# Altium schematic sheet DIOT_SMA_BASE.schdoc: DIOT_SMA16
size 594 x 420 mm; Author: A.B.; CompanyName: WUT; DrawnBy: A.B.; Organization: WUT ISE; Address1: Warsaw Univeristy of Technology; Address2: Nowowiejska 15/19; DocumentNumber: 1; SheetNumber: 1; SheetTotal: 2; EDA_Number: DIOT; Projet: KASLI 3U subsystem; ModifiedBy: -; CreateDate: XX/XX/XXXX; CheckedDate: -; DivGrp: ISE; Designer: A.B.; ModifiedDate: -; ProjectName: KASLI 3U subsystem
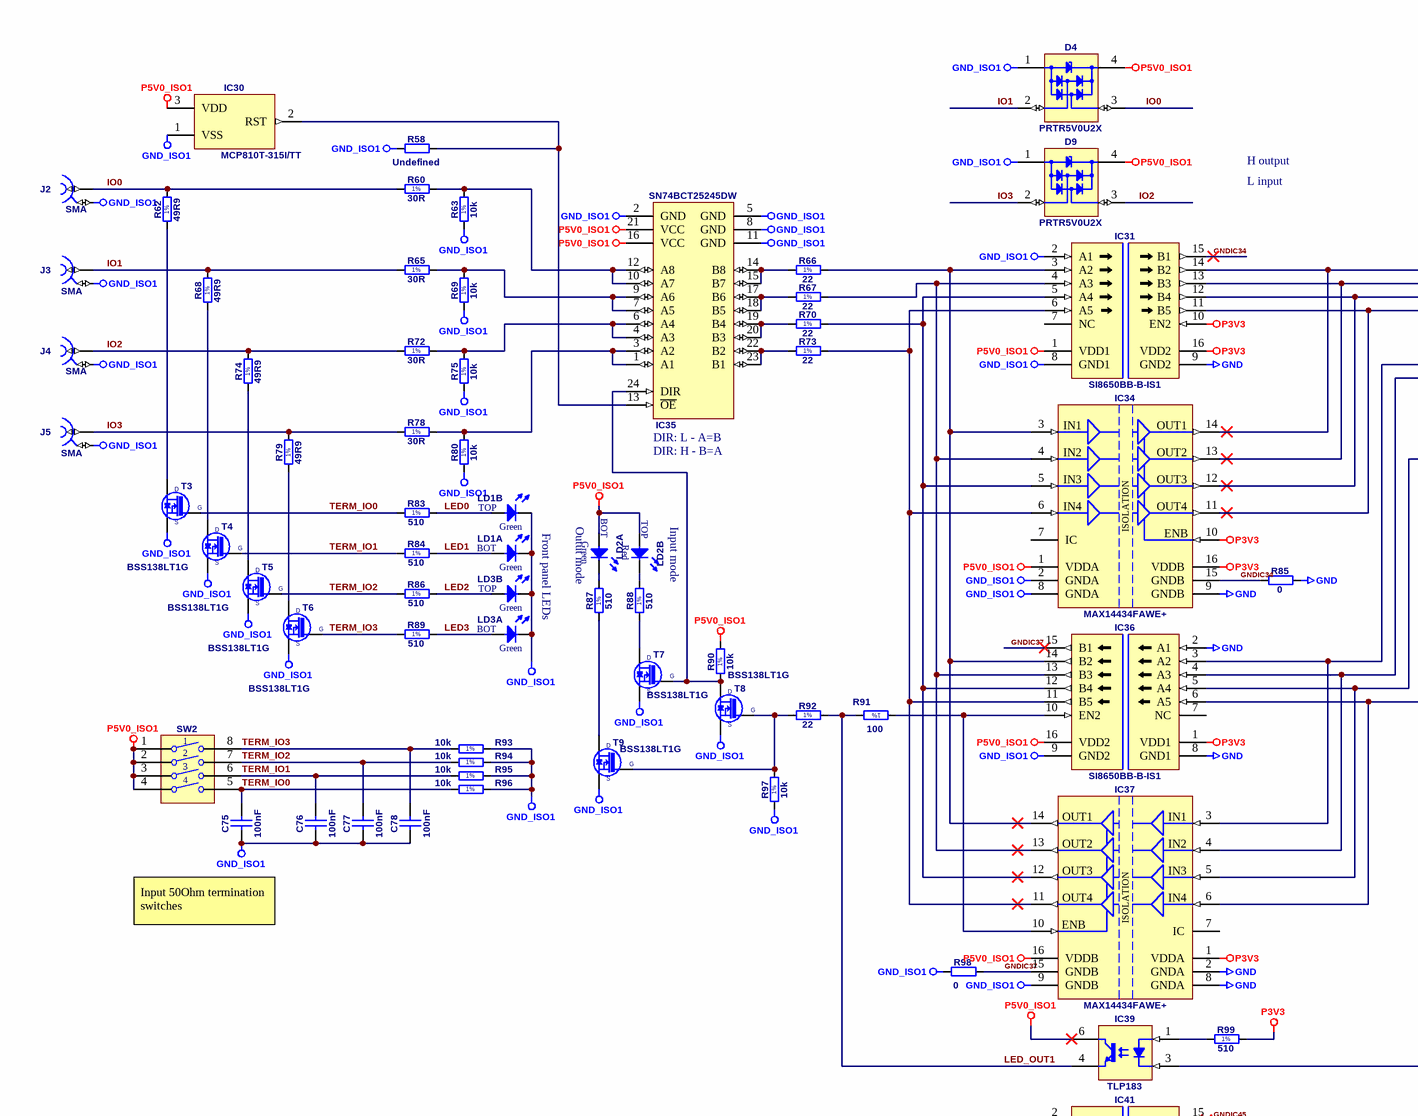
[diagram p0: DIOT_SMA_BASE.schdoc, top left]
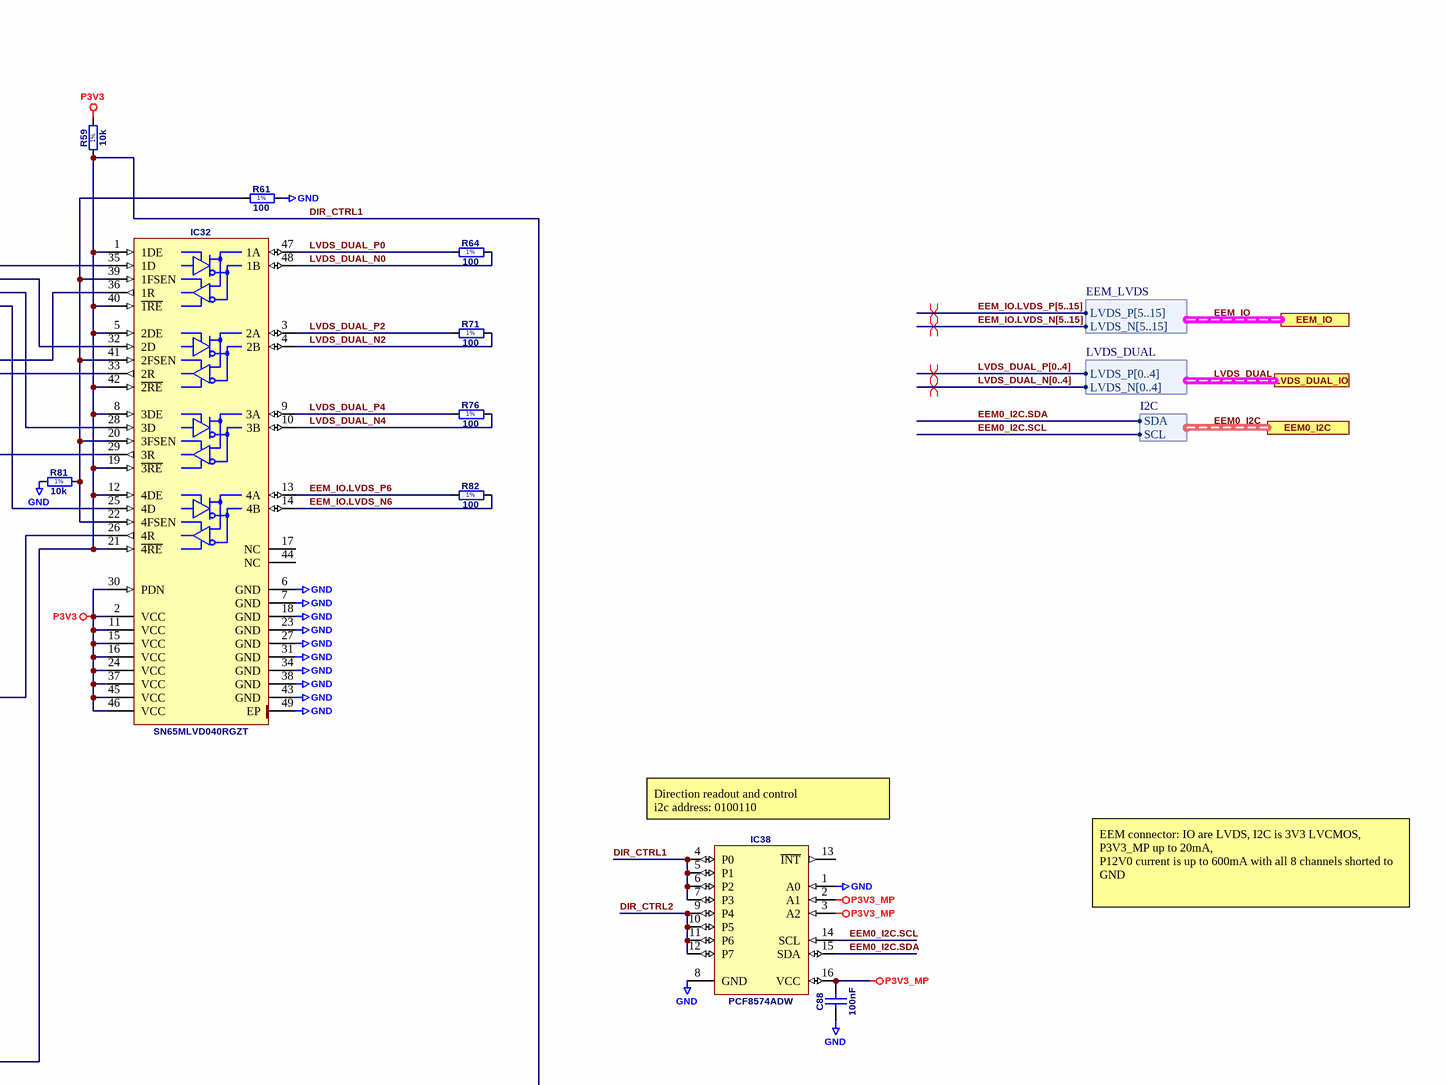
[diagram p1: DIOT_SMA_BASE.schdoc, top right]
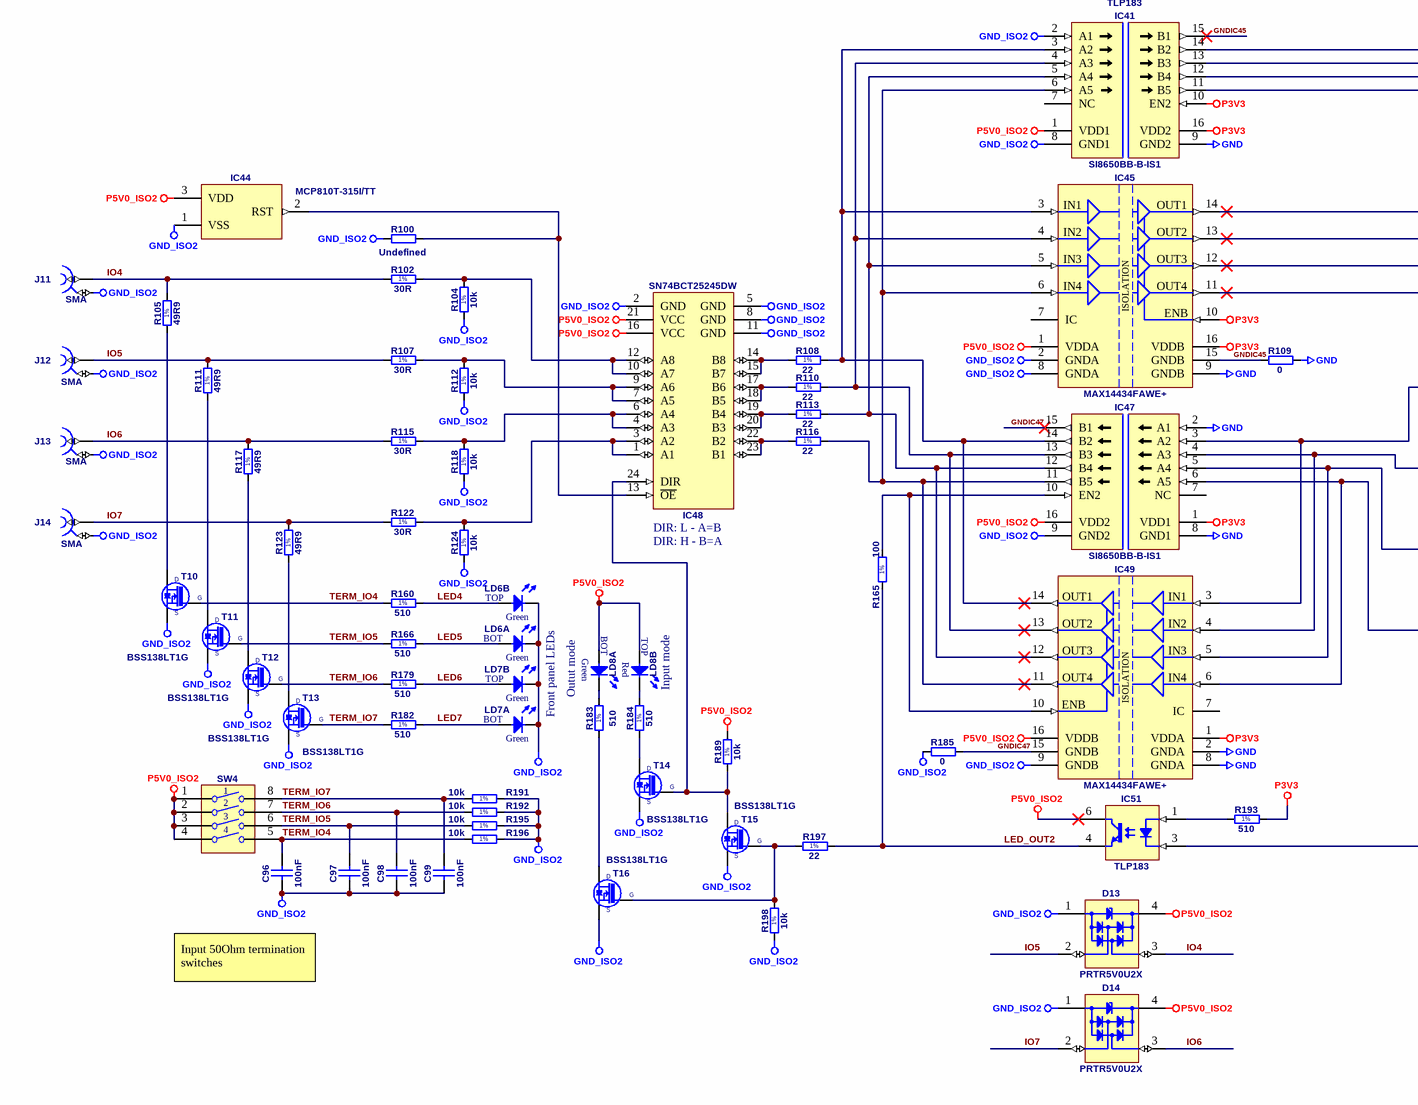
[diagram p2: DIOT_SMA_BASE.schdoc, bottom left]
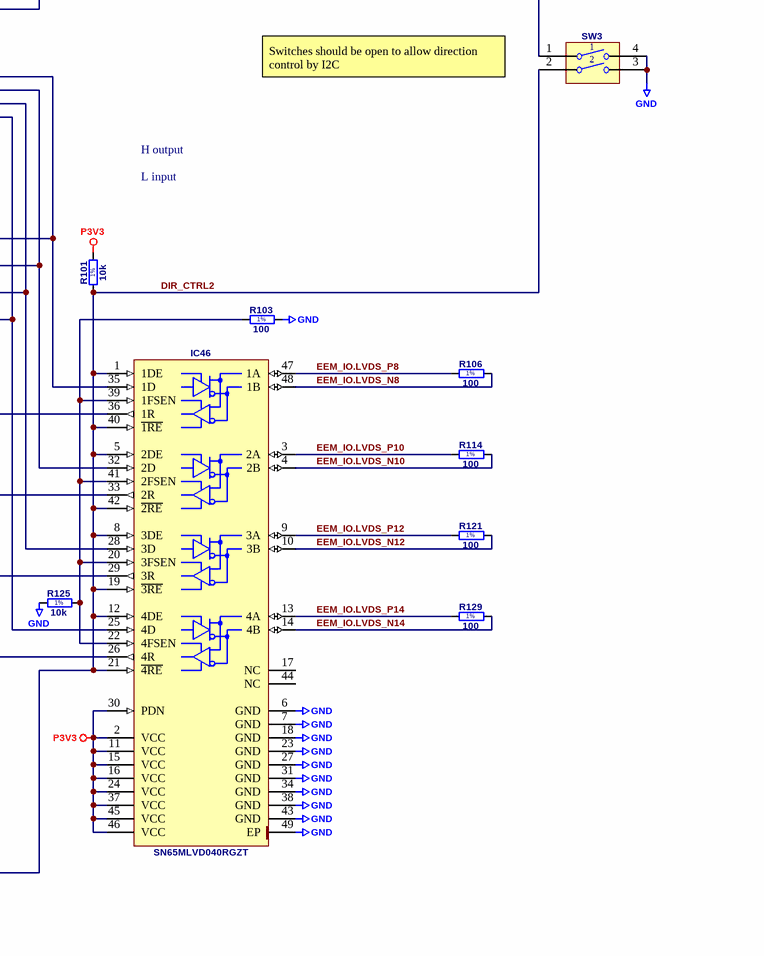
[diagram p3: DIOT_SMA_BASE.schdoc, bottom right]

## Parts
C75  100nF  [CAPC1005X55N]
C76  100nF  [CAPC1005X55N]
C77  100nF  [CAPC1005X55N]
C78  100nF  [CAPC1005X55N]
C88  100nF  [CAPC1005X55N]
C96  100nF  [CAPC1005X55N]
C97  100nF  [CAPC1005X55N]
C98  100nF  [CAPC1005X55N]
C99  100nF  [CAPC1005X55N]
D4  PRTR5V0U2X  [SOT190P230X110-4N]
D9  PRTR5V0U2X  [SOT190P230X110-4N]
D13  PRTR5V0U2X  [SOT190P230X110-4N]
D14  PRTR5V0U2X  [SOT190P230X110-4N]
IC30  MCP810T-315I/TT  [SOT95P237X112-3N]
IC31  SI8650BB-B-IS1  [SOIC127P600X175-16N]
IC32  SN65MLVD040RGZT  [QFN50P700X700X100-49N-S420]
IC34  MAX14434FAWE+  [SOIC127P1030X265-16N]
IC35  SN74BCT25245DW  [SOIC127P1030X265-24N]
IC36  SI8650BB-B-IS1  [SOIC127P600X175-16N]
IC37  MAX14434FAWE+  [SOIC127P1030X265-16N]
IC38  PCF8574ADW  [SOIC127P1030X265-16N]
IC39  TLP183  [TOSHIBA_11-4M1S]
IC41  SI8650BB-B-IS1  [SOIC127P600X175-16N]
IC44  MCP810T-315I/TT  [SOT95P237X112-3N]
IC45  MAX14434FAWE+  [SOIC127P1030X265-16N]
IC46  SN65MLVD040RGZT  [QFN50P700X700X100-49N-S420]
IC47  SI8650BB-B-IS1  [SOIC127P600X175-16N]
IC48  SN74BCT25245DW  [SOIC127P1030X265-24N]
IC49  MAX14434FAWE+  [SOIC127P1030X265-16N]
IC51  TLP183  [TOSHIBA_11-4M1S]
J2  SMA  [DELOCK_65848]
J3  SMA  [MOLEX_73251-2121]
J4  SMA  [DELOCK_65848]
J5  SMA  [MOLEX_73251-2121]
J11  SMA  [DELOCK_65848]
J12  SMA  [MOLEX_73251-2121]
J13  SMA  [DELOCK_65848]
J14  SMA  [MOLEX_73251-2121]
LD1  Green/Green  [LED_DIALIGHT_571-0122F]  (value not drawn)  (parts A,B of 2)
LD2  Red/Green  [LED_DIALIGHT_571-0112F]  (value not drawn)  (parts A,B of 2)
LD3  Green/Green  [LED_DIALIGHT_571-0122F]  (value not drawn)  (parts A,B of 2)
LD6  Green/Green  [LED_DIALIGHT_571-0122F]  (value not drawn)  (parts A,B of 2)
LD7  Green/Green  [LED_DIALIGHT_571-0122F]  (value not drawn)  (parts A,B of 2)
LD8  Red/Green  [LED_DIALIGHT_571-0112F]  (value not drawn)  (parts A,B of 2)
R58  Undefined  [RESC1005X40N]
R59  10k  [RESC1005X40N]
R60  30R  [RESC3225X70N]
R61  100  [RESC1005X40N]
R62  49R9  [RESC3225X70N]
R63  10k  [RESC1005X40N]
R64  100  [RESC1005X40N]
R65  30R  [RESC3225X70N]
R66  22  [RESC1005X40N]
R67  22  [RESC1005X40N]
R68  49R9  [RESC3225X70N]
R69  10k  [RESC1005X40N]
R70  22  [RESC1005X40N]
R71  100  [RESC1005X40N]
R72  30R  [RESC3225X70N]
R73  22  [RESC1005X40N]
R74  49R9  [RESC3225X70N]
R75  10k  [RESC1005X40N]
R76  100  [RESC1005X40N]
R78  30R  [RESC3225X70N]
R79  49R9  [RESC3225X70N]
R80  10k  [RESC1005X40N]
R81  10k  [RESC1005X40N]
R82  100  [RESC1005X40N]
R83  510  [RESC1005X40N]
R84  510  [RESC1005X40N]
R85  0  [RESC1005X40N]
R86  510  [RESC1005X40N]
R87  510  [RESC1005X40N]
R88  510  [RESC1005X40N]
R89  510  [RESC1005X40N]
R90  10k  [RESC1005X40N]
R91  100  [RESC1005X40N]
R92  22  [RESC1005X40N]
R93  10k  [RESC1005X40N]
R94  10k  [RESC1005X40N]
R95  10k  [RESC1005X40N]
R96  10k  [RESC1005X40N]
R97  10k  [RESC1005X40N]
R98  0  [RESC1005X40N]
R99  510  [RESC1005X40N]
R100  Undefined  [RESC1005X40N]
R101  10k  [RESC1005X40N]
R102  30R  [RESC3225X70N]
R103  100  [RESC1005X40N]
R104  10k  [RESC1005X40N]
R105  49R9  [RESC3225X70N]
R106  100  [RESC1005X40N]
R107  30R  [RESC3225X70N]
R108  22  [RESC1005X40N]
R109  0  [RESC1005X40N]
R110  22  [RESC1005X40N]
R111  49R9  [RESC3225X70N]
R112  10k  [RESC1005X40N]
R113  22  [RESC1005X40N]
R114  100  [RESC1005X40N]
R115  30R  [RESC3225X70N]
R116  22  [RESC1005X40N]
R117  49R9  [RESC3225X70N]
R118  10k  [RESC1005X40N]
R121  100  [RESC1005X40N]
R122  30R  [RESC3225X70N]
R123  49R9  [RESC3225X70N]
R124  10k  [RESC1005X40N]
R125  10k  [RESC1005X40N]
R129  100  [RESC1005X40N]
R160  510  [RESC1005X40N]
R165  100  [RESC1005X40N]
R166  510  [RESC1005X40N]
R179  510  [RESC1005X40N]
R182  510  [RESC1005X40N]
R183  510  [RESC1005X40N]
R184  510  [RESC1005X40N]
R185  0  [RESC1005X40N]
R189  10k  [RESC1005X40N]
R191  10k  [RESC1005X40N]
R192  10k  [RESC1005X40N]
R193  510  [RESC1005X40N]
R195  10k  [RESC1005X40N]
R196  10k  [RESC1005X40N]
R197  22  [RESC1005X40N]
R198  10k  [RESC1005X40N]
SW2  Switch  [SW_OMRON_A6S-4102-H]  (value not drawn)
SW3  Switch  [SW_OMRON_A6S-2102-H]  (value not drawn)
SW4  Switch  [SW_OMRON_A6S-4102-H]  (value not drawn)
T3  BSS138LT1G  [SOT95P240X110-3N]
T4  BSS138LT1G  [SOT95P240X110-3N]
T5  BSS138LT1G  [SOT95P240X110-3N]
T6  BSS138LT1G  [SOT95P240X110-3N]
T7  BSS138LT1G  [SOT95P240X110-3N]
T8  BSS138LT1G  [SOT95P240X110-3N]
T9  BSS138LT1G  [SOT95P240X110-3N]
T10  BSS138LT1G  [SOT95P240X110-3N]
T11  BSS138LT1G  [SOT95P240X110-3N]
T12  BSS138LT1G  [SOT95P240X110-3N]
T13  BSS138LT1G  [SOT95P240X110-3N]
T14  BSS138LT1G  [SOT95P240X110-3N]
T15  BSS138LT1G  [SOT95P240X110-3N]
T16  BSS138LT1G  [SOT95P240X110-3N]

## Ports
EEM0_I2C (harness I2C), EEM_IO (harness EEM_LVDS), LVDS_DUAL_IO (harness LVDS_DUAL)

## Harnesses
EEM_LVDS: LVDS_P[5..15], LVDS_N[5..15]
LVDS_DUAL: LVDS_P[0..4], LVDS_N[0..4]
I2C: SDA, SCL

## Nets
GND: C88.1 IC31.9(GND2) IC32.6(GND) IC32.7(GND) IC32.18(GND) IC32.23(GND) IC32.27(GND) IC32.31(GND) IC32.34(GND) IC32.38(GND) IC32.43(GND) IC32.49(EP) IC34.9(GNDB) IC36.2(A1) IC36.8(GND1) IC37.2(GNDA) IC37.8(GNDA) IC38.1(A0) IC38.8(GND) IC41.9(GND2) IC45.9(GNDB) IC46.6(GND) IC46.7(GND) IC46.18(GND) IC46.23(GND) IC46.27(GND) IC46.31(GND) IC46.34(GND) IC46.38(GND) IC46.43(GND) IC46.49(EP) IC47.2(A1) IC47.8(GND1) IC49.2(GNDA) IC49.8(GNDA) R61.2 R81.2 R85.2 R103.2 R109.2 R125.2 SW3.3 SW3.4
GND_ISO1: C75.1 C76.1 C77.1 C78.1 D4.1(GND) D9.1(GND) IC30.1(VSS) IC31.2(A1) IC31.8(GND1) IC34.2(GNDA) IC34.8(GNDA) IC35.2(GND) IC35.5(GND) IC35.8(GND) IC35.11(GND) IC36.9(GND2) IC37.9(GNDB) J2.2 J3.2 J4.2 J5.2 LD1.1(C) LD1.3(C) LD3.1(C) LD3.3(C) R58.1 R63.1 R69.1 R75.1 R80.1 R93.2 R94.2 R95.2 R96.2 R97.1 R98.1 T3.2(S) T4.2(S) T5.2(S) T6.2(S) T7.2(S) T8.2(S) T9.2(S)
GND_ISO2: C96.1 C97.1 C98.1 C99.1 D13.1(GND) D14.1(GND) IC41.2(A1) IC41.8(GND1) IC44.1(VSS) IC45.2(GNDA) IC45.8(GNDA) IC47.9(GND2) IC48.2(GND) IC48.5(GND) IC48.8(GND) IC48.11(GND) IC49.9(GNDB) J11.2 J12.2 J13.2 J14.2 LD6.1(C) LD6.3(C) LD7.1(C) LD7.3(C) R100.1 R104.1 R112.1 R118.1 R124.1 R185.1 R191.2 R192.2 R195.2 R196.2 R198.1 T10.2(S) T11.2(S) T12.2(S) T13.2(S) T14.2(S) T15.2(S) T16.2(S)
P3V3: IC31.10(EN2) IC31.16(VDD2) IC32.2(VCC) IC32.11(VCC) IC32.15(VCC) IC32.16(VCC) IC32.24(VCC) IC32.30(PDN) IC32.37(VCC) IC32.45(VCC) IC32.46(VCC) IC34.10(ENB) IC34.16(VDDB) IC36.1(VDD1) IC37.1(VDDA) IC41.10(EN2) IC41.16(VDD2) IC45.10(ENB) IC45.16(VDDB) IC46.2(VCC) IC46.11(VCC) IC46.15(VCC) IC46.16(VCC) IC46.24(VCC) IC46.30(PDN) IC46.37(VCC) IC46.45(VCC) IC46.46(VCC) IC47.1(VDD1) IC49.1(VDDA) R59.2 R99.2 R101.2 R193.2
P3V3_MP: C88.2 IC38.2(A1) IC38.3(A2) IC38.16(VCC)
P5V0_ISO1: D4.4(VCC) D9.4(VCC) IC30.3(VDD) IC31.1(VDD1) IC34.1(VDDA) IC35.16(VCC) IC35.21(VCC) IC36.16(VDD2) IC37.16(VDDB) IC39.6(C) LD2.2(A) LD2.4(A) R90.2 SW2.1 SW2.2 SW2.3 SW2.4
P5V0_ISO2: D13.4(VCC) D14.4(VCC) IC41.1(VDD1) IC44.3(VDD) IC45.1(VDDA) IC47.16(VDD2) IC48.16(VCC) IC48.21(VCC) IC49.16(VDDB) IC51.6(C) LD8.2(A) LD8.4(A) R189.2 SW4.1 SW4.2 SW4.3 SW4.4
DIR_CTRL1: IC32.1(1DE) IC32.5(2DE) IC32.8(3DE) IC32.12(4DE) IC32.19(~{3RE}) IC32.21(~{4RE}) IC32.40(~{1RE}) IC32.42(~{2RE}) IC38.4(P0) IC38.5(P1) IC38.6(P2) IC38.7(P3) IC39.3(C) R59.1 SW3.1
DIR_CTRL2: IC38.9(P4) IC38.10(P5) IC38.11(P6) IC38.12(P7) IC46.1(1DE) IC46.5(2DE) IC46.8(3DE) IC46.12(4DE) IC46.19(~{3RE}) IC46.21(~{4RE}) IC46.40(~{1RE}) IC46.42(~{2RE}) IC51.3(C) R101.1 SW3.2
EEM0_I2C.SCL: IC38.14(SCL) ; port EEM0_I2C.SCL
EEM0_I2C.SDA: IC38.15(SDA) ; port EEM0_I2C.SDA
EEM_IO.LVDS_N6: IC32.14(4B) R82.2
EEM_IO.LVDS_N8: IC46.48(1B) R106.2
EEM_IO.LVDS_N10: IC46.4(2B) R114.2
EEM_IO.LVDS_N12: IC46.10(3B) R121.2
EEM_IO.LVDS_N14: IC46.14(4B) R129.2
EEM_IO.LVDS_P6: IC32.13(4A) R82.1
EEM_IO.LVDS_P8: IC46.47(1A) R106.1
EEM_IO.LVDS_P10: IC46.3(2A) R114.1
EEM_IO.LVDS_P12: IC46.9(3A) R121.1
EEM_IO.LVDS_P14: IC46.13(4A) R129.1
GNDIC34: IC31.15(B1) IC34.15(GNDB) R85.1
GNDIC37: IC36.15(B1) IC37.15(GNDB) R98.2
GNDIC45: IC41.15(B1) IC45.15(GNDB) R109.1
GNDIC47: IC47.15(B1) IC49.15(GNDB) R185.2
IO0: D4.3(I/O2) J2.1 R60.1 R62.2
IO1: D4.2(I/O1) J3.1 R65.1 R68.2
IO2: D9.3(I/O2) J4.1 R72.1 R74.2
IO3: D9.2(I/O1) J5.1 R78.1 R79.2
IO4: D13.3(I/O2) J11.1 R102.1 R105.2
IO5: D13.2(I/O1) J12.1 R107.1 R111.2
IO6: D14.3(I/O2) J13.1 R115.1 R117.2
IO7: D14.2(I/O1) J14.1 R122.1 R123.2
LED0: LD1.4(A) R83.2
LED1: LD1.2(A) R84.2
LED2: LD3.4(A) R86.2
LED3: LD3.2(A) R89.2
LED4: LD6.4(A) R160.2
LED5: LD6.2(A) R166.2
LED6: LD7.4(A) R179.2
LED7: LD7.2(A) R182.2
LED_OUT1: IC39.4(E) R91.2 R92.2
LED_OUT2: IC51.4(E) R165.1 R197.2
LVDS_DUAL_N0: IC32.48(1B) R64.2
LVDS_DUAL_N2: IC32.4(2B) R71.2
LVDS_DUAL_N4: IC32.10(3B) R76.2
LVDS_DUAL_P0: IC32.47(1A) R64.1
LVDS_DUAL_P2: IC32.3(2A) R71.1
LVDS_DUAL_P4: IC32.9(3A) R76.1
TERM_IO0: C75.2 R83.1 R96.1 SW2.5 T3.1(G)
TERM_IO1: C76.2 R84.1 R95.1 SW2.6 T4.1(G)
TERM_IO2: C77.2 R86.1 R94.1 SW2.7 T5.1(G)
TERM_IO3: C78.2 R89.1 R93.1 SW2.8 T6.1(G)
TERM_IO4: C96.2 R160.1 R196.1 SW4.5 T10.1(G)
TERM_IO5: C97.2 R166.1 R195.1 SW4.6 T11.1(G)
TERM_IO6: C98.2 R179.1 R192.1 SW4.7 T12.1(G)
TERM_IO7: C99.2 R182.1 R191.1 SW4.8 T13.1(G)
NetIC30_2: IC30.2(RST) IC35.13(~{OE}) R58.2
NetIC31_3: IC31.3(A2) IC34.3(IN1) IC36.14(B2) IC37.14(OUT1) R66.2
NetIC31_4: IC31.4(A3) IC34.4(IN2) IC36.13(B3) IC37.13(OUT2) R67.2
NetIC31_5: IC31.5(A4) IC34.5(IN3) IC36.12(B4) IC37.12(OUT3) R70.2
NetIC31_6: IC31.6(A5) IC34.6(IN4) IC36.11(B5) IC37.11(OUT4) R73.2
NetIC31_11: IC31.11(B5) IC32.25(4D) IC34.11(OUT4)
NetIC31_12: IC31.12(B4) IC32.28(3D) IC34.12(OUT3)
NetIC31_13: IC31.13(B3) IC32.32(2D) IC34.13(OUT2)
NetIC31_14: IC31.14(B2) IC32.35(1D) IC34.14(OUT1)
NetIC32_20: IC32.20(3FSEN) IC32.22(4FSEN) IC32.39(1FSEN) IC32.41(2FSEN) R61.1 R81.1
NetIC32_26: IC32.26(4R) IC36.6(A5) IC37.6(IN4)
NetIC32_29: IC32.29(3R) IC36.5(A4) IC37.5(IN3)
NetIC32_33: IC32.33(2R) IC36.4(A3) IC37.4(IN2)
NetIC32_36: IC32.36(1R) IC36.3(A2) IC37.3(IN1)
NetIC35_1: IC35.1(A1) IC35.3(A2) R78.2 R80.2
NetIC35_4: IC35.4(A3) IC35.6(A4) R72.2 R75.2
NetIC35_7: IC35.7(A5) IC35.9(A6) R65.2 R69.2
NetIC35_10: IC35.10(A7) IC35.12(A8) R60.2 R63.2
NetIC35_14: IC35.14(B8) IC35.15(B7) R66.1
NetIC35_17: IC35.17(B6) IC35.18(B5) R67.1
NetIC35_19: IC35.19(B4) IC35.20(B3) R70.1
NetIC35_22: IC35.22(B2) IC35.23(B1) R73.1
NetIC35_24: IC35.24(DIR) R90.1 T7.1(G) T8.3(D)
NetIC36_10: IC36.10(EN2) IC37.10(ENB) R91.1
NetIC39_1: IC39.1(A) R99.1
NetIC41_3: IC41.3(A2) IC45.3(IN1) IC47.14(B2) IC49.14(OUT1) R108.2
NetIC41_4: IC41.4(A3) IC45.4(IN2) IC47.13(B3) IC49.13(OUT2) R110.2
NetIC41_5: IC41.5(A4) IC45.5(IN3) IC47.12(B4) IC49.12(OUT3) R113.2
NetIC41_6: IC41.6(A5) IC45.6(IN4) IC47.11(B5) IC49.11(OUT4) R116.2
NetIC41_11: IC41.11(B5) IC45.11(OUT4) IC46.25(4D)
NetIC41_12: IC41.12(B4) IC45.12(OUT3) IC46.28(3D)
NetIC41_13: IC41.13(B3) IC45.13(OUT2) IC46.32(2D)
NetIC41_14: IC41.14(B2) IC45.14(OUT1) IC46.35(1D)
NetIC44_2: IC44.2(RST) IC48.13(~{OE}) R100.2
NetIC46_20: IC46.20(3FSEN) IC46.22(4FSEN) IC46.39(1FSEN) IC46.41(2FSEN) R103.1 R125.1
NetIC46_26: IC46.26(4R) IC47.6(A5) IC49.6(IN4)
NetIC46_29: IC46.29(3R) IC47.5(A4) IC49.5(IN3)
NetIC46_33: IC46.33(2R) IC47.4(A3) IC49.4(IN2)
NetIC46_36: IC46.36(1R) IC47.3(A2) IC49.3(IN1)
NetIC47_10: IC47.10(EN2) IC49.10(ENB) R165.2
NetIC48_1: IC48.1(A1) IC48.3(A2) R122.2 R124.2
NetIC48_4: IC48.4(A3) IC48.6(A4) R115.2 R118.2
NetIC48_7: IC48.7(A5) IC48.9(A6) R107.2 R112.2
NetIC48_10: IC48.10(A7) IC48.12(A8) R102.2 R104.2
NetIC48_14: IC48.14(B8) IC48.15(B7) R108.1
NetIC48_17: IC48.17(B6) IC48.18(B5) R110.1
NetIC48_19: IC48.19(B4) IC48.20(B3) R113.1
NetIC48_22: IC48.22(B2) IC48.23(B1) R116.1
NetIC48_24: IC48.24(DIR) R189.1 T14.1(G) T15.3(D)
NetIC51_1: IC51.1(A) R193.1
NetLD2_1: LD2.1(C) R87.2
NetLD2_3: LD2.3(C) R88.2
NetLD8_1: LD8.1(C) R183.2
NetLD8_3: LD8.3(C) R184.2
NetR62_1: R62.1 T3.3(D)
NetR68_1: R68.1 T4.3(D)
NetR74_1: R74.1 T5.3(D)
NetR79_1: R79.1 T6.3(D)
NetR87_1: R87.1 T9.3(D)
NetR88_1: R88.1 T7.3(D)
NetR92_1: R92.1 R97.2 T8.1(G) T9.1(G)
NetR105_1: R105.1 T10.3(D)
NetR111_1: R111.1 T11.3(D)
NetR117_1: R117.1 T12.3(D)
NetR123_1: R123.1 T13.3(D)
NetR183_1: R183.1 T16.3(D)
NetR184_1: R184.1 T14.3(D)
NetR197_1: R197.1 R198.2 T15.1(G) T16.1(G)

Not connected (* = marked no-connect by the designer): IC31 7(NC); IC32 17(NC) 44(NC); IC34 7(IC); IC36 7(NC); IC37 7(IC); IC38 13(~{INT}); IC41 7(NC); IC45 7(IC); IC46 17(NC) 44(NC); IC47 7(NC); IC49 7(IC)

## Buses and harness runs
bus EEM_IO.LVDS_N[5..15]
bus EEM_IO.LVDS_P[5..15]
bus LVDS_DUAL_N[0..4]
bus LVDS_DUAL_P[0..4]
harness EEM0_I2C = port EEM0_I2C
harness EEM_IO = port EEM_IO
harness LVDS_DUAL = port LVDS_DUAL_IO

## Layout directives
differential pair; differential pair class Diff_100Ohm: (no net found under the mark)

## Notes on the sheet
- H output
- L input
- (near IC35) DIR: L - A=B
- (near IC35) DIR: H - B=A
- Front panel LEDs
- Outut mode
- Input mode
- (near IC38) Direction readout and control
  i2c address: 0100110
- Input 50Ohm termination switches
- EEM connector: IO are LVDS, I2C is 3V3 LVCMOS, P3V3_MP up to 20mA,
  P12V0 current is up to 600mA with all 8 channels shorted to GND
- Switches should be open to allow direction control by I2C
- (near IC48) DIR: L - A=B
- (near IC48) DIR: H - B=A
- Project/Equipment
- Document
- File
- Designer
- Drawn by
- Check.by
- Last Mod.
- Copyright WUT ISE 2020.
  This documentation describes Open Hardware and is licensed under the CERN OHL v.1.2. You may redistribute and modify this documentation under the terms of the CERN OHL v.1.2. (http://ohwr.org/CERNOHL). This documentation is distributed WITHOUT ANY EXPRESS OR IMPLIED WARRANTY, INCLUDING OF MERCHANTABILITY, SATISFACTORY QUALITY AND FITNESS FOR A PARTICULAR PURPOSE. Please see the CERN OHL v.1.2 for applicable conditions.
- Contact
- Print Date
- Sheet
- Size
- A2
- of
- Rev
- (in symbol LED_DIALIGHT_571-0112F, part A) BOT; Green
- (in symbol LED_DIALIGHT_571-0112F, part B) TOP; Red
- (in symbol LED_DIALIGHT_571-0122F, part A) BOT; Green
- (in symbol LED_DIALIGHT_571-0122F, part B) TOP; Green
- (in symbol MAX14434FAWE+) ISOLATION
- (in symbol R0402_10K_1%_0.0625W_100PPM) 1%
- (in symbol R0402_22R_1%_0.0625W_100PPM) 1%
- (in symbol R0402_100R_1%_0.1W_100PPM) 1%
- (in symbol R0402_510R_1%_0.0625W_100PPM) 1%
- (in symbol R1210_30R_5%_0.5W_200PPM) 1%
- (in symbol R1210_49R9_1%_0.5W_100PPM_VISHAY_CRCW) 1%

## Library data of the parts
C75-C78 C88 C96-C99 = CC0402_100NF_16V_10%_X5R: Non-polarised capacitor; Part Description: SMD Multilayer Chip Ceramic Capacitor; Manufacturer: GENERIC; Manufacturer1 Part Number: GRM155R61C104KA88D; Voltage: 16V; TC: X5R; Tolerance: ±10%; Part Number: CC0402_100NF_16V_10%_X5R; Component Kind: Standard; Component Type: Standard; Pin Count: 2; Value: 100nF; Status: None; Manufacturer Part Number: CC0402_100NF_16V_10%_X5R; Case: 0402; Mounted: Yes; Socket: No; SMD: Yes; Sense: No; Manufacturer1 Example: MURATA; Manufacturer1 ComponentHeight: 0.55mm; HelpURL: \\cern.ch\dfs\Applications\Altium\Datasheets\CC0402_X5R_MURATA_GRM.pdf; Author: CERN DEM JLC; CreateDate: 10.12.2013; LatestRevisionDate: 10.12.2013
D4 D9 D13 D14 = PRTR5V0U2X: Ultra Low Capacitance Double Rail-to-Rail ESD Protection Diode; Part Description: Ultra Low Capacitance (1pF) Double Rail-to-Rail ESD Protection Diode (8kV); Manufacturer: NXP SEMICONDUCTORS; Voltage: 5.5V; PressFit: No; Bonding: No; Part Number: PRTR5V0U2X; Component Kind: Standard; Component Type: Standard; Device: PRTR5V0U2X; PackageDescription: SOT143B, SOT, 1.90mm Pitch; 4 Pin, 1.30mm W X 2.90mm L X 1.10mm H body, IPC Medium Density; Manufacturer Part Number: PRTR5V0U2X; Pin Count: 4; Case: SOT143B; Mounted: Yes; Socket: No; SMD: Yes; Sense: No; ComponentHeight: 1.1mm; HelpURL: \\cern.ch\dfs\Applications\Altium\Datasheets\PRTR5V0U2X.pdf; Author: CERN DEM JLC; CreateDate: 22.03.2011; LatestRevisionDate: 22.03.2011
IC30 IC44 = VMON_MCP810: 3.075V Microcontroller Supervisory Circuit With Push-Pull Output; Manufacturer: MICROCHIP TECHNOLOGY; PressFit: No; Bonding: No; Part Number: MCP810T-315I/TT; Component Kind: Standard; Component Type: Standard; Device: MCP810T-315I/TT; PackageDescription: SOT, 0.95mm, pitch; 3 pin,1.30mm W X 2.92mm L X 1.12mm H body, IPC Medium Density; Part Description: 3.075V Microcontroller Supervisory Circuit With Push-Pull Output; Manufacturer Part Number: MCP810T-315I/TT; Pin Count: 3; Case: SOT23; Mounted: Yes; Socket: No; SMD: Yes; Sense: No; ComponentHeight: 1.12mm; Author: GK; HelpURL: \\cern.ch\dfs\Applications\Altium\Datasheets\MCP809T-315I-TT.pdf; CreateDate: 16.06.2011; LatestRevisionDate: 16.06.2011
IC31 IC36 IC41 IC47 = SI8650BB-B-IS1: Low Power Five-Channel Digital Isolator; Part Description: 2.5kV 150Mbps Low Power Five-Channel Digital Isolator; Manufacturer: SKYWORKS; Manufacturer Part Number: SI8651BB-B-IS1; PressFit: No; Bonding: No; Part Number: SI8650BB-B-IS1; Component Kind: Standard; Component Type: Standard; Device: SI8650BB-B-IS1; PackageDescription: SOIC 16, Pitch 1.27mm - Body 4x10mm, IPC Medium Density; Pin Count: 16; Case: SOIC16; Mounted: Yes; Socket: No; SMD: Yes; Sense: No; ComponentHeight: 1.75mm; Author: CERN DEM HF; HelpURL: \\cern.ch\dfs\Applications\Altium\Datasheets\SI8650BB-B-IS1.pdf; CreateDate: 14.10.2021; LatestRevisionDate: 14.10.2021
IC32 IC46 = SN65MLVD040RGZT: 4-Channel Half-Duplex M-LVDS Line Transceiver; Manufacturer: TEXAS INSTRUMENTS; PressFit: No; Bonding: No; Part Number: SN65MLVD040RGZT; Component Kind: Standard; Component Type: Standard; Device: SN65MLVD040RGZT; PackageDescription: QFN, 0.50mm Pitch, Square; 48 Pin, 7.00mm L X 7.00mm W X 1mm H body (W/Thermal Tab 4.2mm X 4.2mm), IPC Medium Density; Part Description: 4-Channel Half-Duplex M-LVDS Line Transceiver; Manufacturer Part Number: SN65MLVD040RGZT; Pin Count: 49; Case: QFN48; Mounted: Yes; Socket: No; SMD: Yes; Sense: No; ComponentHeight: 1mm; Author: CERN DEM JLC; HelpURL: \\cern.ch\dfs\Applications\Altium\Datasheets\SN65MLVD040RGZT.pdf; CreateDate: 17.03.2011; LatestRevisionDate: 17.03.2011
IC34 IC37 IC45 IC49 = MAX14434FAWE+: Four-Channel, Fast, Low-Power, 5kVRMS Digital Isolators; Part Description: Four-Channel, Fast, Low-Power, 5kVRMS Digital Isolators, Data Rate 200 Mbps, Default Output Low; Manufacturer: MAXIM; PressFit: No; Bonding: No; Part Number: MAX14434FAWE+; Component Kind: Standard; Component Type: Standard; Device: MAX14434FAWE+; PackageDescription: SOIC, 1.27mm Pitch; 16 Pin, 7.50mm W X 10.3mm L X 2.65mm H body, IPC Medium Density; Manufacturer Part Number: MAX14434FAWE+; Pin Count: 16; Case: SOIC16W; Mounted: Yes; Socket: No; SMD: Yes; Sense: No; ComponentHeight: 2.65mm; Author: CERN DEM HF; HelpURL: \\cern.ch\dfs\Applications\Altium\Datasheets\MAX14434.pdf; CreateDate: 29.11.2021; LatestRevisionDate: 29.11.2021
IC35 IC48 = SN74BCT25245DW: 25 Ohms Octal Bus Transceiver With 3-State Outputs; Manufacturer: TEXAS INSTRUMENTS; PressFit: No; Bonding: No; Part Number: SN74BCT25245DW; Component Kind: Standard; Component Type: Standard; Device: SN74BCT25245DW; PackageDescription: SOIC 24, Pitch 1.27mm - Body 7.6x15.6mm, IPC Medium Density; Part Description: 25 Ohms Octal Bus Transceiver With 3-State Outputs; Manufacturer Part Number: SN74BCT25245DW; Pin Count: 24; Case: SOIC24; Mounted: Yes; Socket: No; SMD: Yes; Sense: No; ComponentHeight: 2.65mm; Author: CERN DEM JLC; HelpURL: \\cern.ch\dfs\Applications\Altium\Datasheets\SN74BCT25245DW.pdf; CreateDate: 09.11.2009; LatestRevisionDate: 09.11.2009
IC38 = PCF8574ADW: Remote 8-bit I/O Expander For I2C Bus; Manufacturer: TEXAS INSTRUMENTS; PressFit: No; Bonding: No; Part Number: PCF8574ADW; Component Kind: Standard; Component Type: Standard; Device: PCF8574ADW; PackageDescription: SOIC 16, Pitch 1.27mm - Body 7.5x10.3mm, IPC Medium Density; Part Description: Remote 8-bit I/O Expander For I2C Bus; Manufacturer Part Number: PCF8574ADW; Pin Count: 16; Case: SOIC16W; Mounted: Yes; Socket: No; SMD: Yes; Sense: No; ComponentHeight: 2.65mm; Author: CERN DEM JLC; HelpURL: \\cern.ch\dfs\Applications\Altium\Datasheets\PCF8574ADW.pdf; CreateDate: 01.11.2012; LatestRevisionDate: 01.11.2012
IC39 IC51 = TLP183: Single Optocoupler; Part Description: Photocoupler InGaAs Infrared LED & Photo-Transistor; Manufacturer: TOSHIBA; PressFit: No; Bonding: No; Part Number: TLP183; Component Kind: Standard; Component Type: Standard; Device: TLP183; PackageDescription: SOIC, 1.27mm Pitch; 4 Pin, TOSHIBA Case (5mm Creepage); Manufacturer Part Number: TLP183; Pin Count: 4; Case: SOIC4; Mounted: Yes; Socket: No; SMD: Yes; Sense: No; ComponentHeight: 2.3mm; HelpURL: \\cern.ch\dfs\Applications\Altium\Datasheets\TLP183.pdf; Author: CERN DEM JMW; CreateDate: 05.10.2015; LatestRevisionDate: 04.09.2017
J2 J4 J11 J13 = DELOCK_65848: 50 Ohm Through Hole SMA Right Angle PCB Jack; Manufacturer: DELOCK; Manufacturer Part Number: 5848 (4043619658480); PressFit: No; Part Number: DELOCK_65848; Component Kind: Standard; Component Type: Standard; Pin Count: 5; Family: SMA; Mounted: Yes; Socket: No; SMD: No; Sense: No; Status: None; Part Description: 50 Ohm Through Hole SMA Right Angle PCB Jack; ComponentHeight: 12.5; HelpURL: \\cern.ch\dfs\Applications\Altium\Datasheets\AMPHENOL_132203-16.pdf; Author: GK; CreateDate: 13.05.2019; LatestRevisionDate: 13.05.2019
J3 J5 J12 J14 = MOLEX_73251-2121: Part Description: 50 Ohms SMA Edge Mount PCB, With Jam Nut And Lock Washer; Manufacturer: MOLEX; PressFit: No; Part Number: MOLEX_73251-2121; Component Kind: Standard; Component Type: Standard; Pin Count: 5; Family: SMA; Mounted: Yes; Socket: No; SMD: No; Sense: No; Status: None; Manufacturer Part Number: 73251-2121; ComponentHeight: 5.75mm; HelpURL: \\cern.ch\dfs\Applications\Altium\Datasheets\MOLEX_73251-2121.pdf; Author: CERN DEM JLC; CreateDate: 26.10.2016; LatestRevisionDate: 27.03.2017
LD1 LD3 LD6 LD7 = LED_DIALIGHT_571-0122F: LED x2 Green 1C2A-BOT_3C4A-TOP; Part Description: Dual 2mm Green LEDs CBI® Circuit Board Indicator (Without positioning pins); PressFit: No; Bonding: No; Part Number: LED_DIALIGHT_571-0122F; Component Kind: Standard; Component Type: Standard; Color: Green/Green; PackageDescription: 2x 2mm Red LED PCB Edge Mounting (Without positioning pins) DIALIGHT 571 Serie; Manufacturer: DIALIGHT; Manufacturer Part Number: 571-0122F; Pin Count: 4; Mounted: Yes; Socket: No; SMD: No; Sense: No; ComponentHeight: 8.6mm; HelpURL: \\cern.ch\dfs\Applications\Altium\Datasheets\LED_DIALIGHT_571-0122F.pdf; Author: CERN DEM JLC; CreateDate: 09.11.2009; LatestRevisionDate: 17.03.2010
LD2 LD8 = LED_DIALIGHT_571-0112F: 2x LED  Botom Green, Top Red; Part Description: Dual 2mm  LEDs, Red Top,Green Bot, CBI® Circuit Board Indicator (Without positioning pins); PressFit: No; Bonding: No; Part Number: LED_DIALIGHT_571-0112F; Component Kind: Standard; Component Type: Standard; Color: Red/Green; PackageDescription: 2x 2mm LED (Top: Red, Bot: Green) PCB Edge Mounting (Without positioning pins) DIALIGHT 571 Serie; Manufacturer: DIALIGHT; Manufacturer Part Number: 571-0112F; Pin Count: 4; Mounted: Yes; Socket: No; SMD: No; Sense: No; ComponentHeight: 8.6mm; HelpURL: \\cern.ch\dfs\Applications\Altium\Datasheets\LED_DIALIGHT_571-0112F.pdf; Author: CERN DEM JLC; CreateDate: 09.11.2009; LatestRevisionDate: 17.03.2010
R58 R100 = R0402_NO-VALUE: Resistor; Part Description: Reserved Footprint For a 0402 (1005) Chip Resistor; PressFit: No; Mounted: No; Part Number: R0402_NO-VALUE; Component Kind: Standard; Component Type: Standard; Pin Count: 2; Value: Undefined; Status: None; Manufacturer: Undefined; Manufacturer Part Number: R0402_NO-VALUE; Case: 0402; Sense: No; Socket: No; SMD: Yes; Manufacturer1 Example: Undefined; Manufacturer1 Part Number: Undefined; Manufacturer1 ComponentHeight: Undefined; HelpURL: Undefined; Author: CERN DEM JLC; CreateDate: 03.12.2007; LatestRevisionDate: 13.03.2008
R59 R63 R69 R75 R80 R81 R90 R93-R97 R101 R104 R112 R118 R124 R125 R189 R191 R192 R195 R196 R198 = R0402_10K_1%_0.0625W_100PPM: Resistor - 1%; Part Description: General Purpose Thick Film Chip Resistor; Manufacturer: GENERIC; Manufacturer1 Part Number: 232270671003L; TC: ±100ppm/°C; Part Number: R0402_10K_1%_0.0625W_100PPM; Component Kind: Standard; Component Type: Standard; Pin Count: 2; Value: 10k; Status: Not recommended; Power: 0.0625W; Tolerance: ±1%; Manufacturer Part Number: R0402_10K_1%_0.0625W_100PPM; Case: 0402; Mounted: Yes; Sense: No; Socket: No; SMD: Yes; Manufacturer1 Example: YAGEO PHYCOMP; Manufacturer1 ComponentHeight: 0.4mm; HelpURL: \\cern.ch\dfs\Applications\Altium\Datasheets\R0402_Phycomp_RC0402.pdf; Author: CERN DEM JLC; CreateDate: 03.12.2007; LatestRevisionDate: 17.10.2012
R60 R65 R72 R78 R102 R107 R115 R122 = R1210_30R_5%_0.5W_200PPM: Resistor - 5%; Part Description: Thick Film Chip Resistor; Manufacturer: VISHAY; Manufacturer Part Number: CRCW121030R0JNEA; Power: 0.5W; TC: ±200ppm/°C; PressFit: No; Part Number: R1210_30R_5%_0.5W_200ppm; Component Kind: Standard; Component Type: Standard; Pin Count: 2; Value: 30R; Status: None; Tolerance: ±5%; Case: 1210; Mounted: Yes; Sense: No; Socket: No; SMD: Yes; HelpURL: \\cern.ch\dfs\Applications\Altium\Datasheets\R1210_VISHAY_CRCW1210.pdf; Author: CERN DEM JMW; CreateDate: 06.08.2014; LatestRevisionDate: 06.08.2014; ComponentHeight: 0.6mm
R61 R64 R71 R76 R82 R91 R103 R106 R114 R121 R129 R165 = R0402_100R_1%_0.1W_100PPM: Resistor - 1%; Part Description: General Purpose Thick Film Chip Resistor; Manufacturer: GENERIC; Manufacturer Part Number: R0402_100R_1%_0.1W_100PPM_50V; Manufacturer1 Part Number: ERJ2RKF1000X; Power: 0.1W; TC: ±100ppm/°C; Voltage: 50V; Part Number: R0402_100R_1%_0.1W_100PPM; Component Kind: Standard; Component Type: Standard; Pin Count: 2; Value: 100; Status: Not recommended; Tolerance: ±1%; Case: 0402; Mounted: Yes; Sense: No; Socket: No; SMD: Yes; Manufacturer1 Example: PANASONIC; Manufacturer1 ComponentHeight: 0.4mm; HelpURL: \\cern.ch\dfs\Applications\Altium\Datasheets\R0402_PANASONIC_ERJ2RK.pdf; Author: CERN DEM JLC; CreateDate: 12.12.2013; LatestRevisionDate: 03.03.2015
R62 R68 R74 R79 R105 R111 R117 R123 = R1210_49R9_1%_0.5W_100PPM_VISHAY_CRCW: Resistor - 1%; Part Description: Thick Film Chip Resistor; Manufacturer: VISHAY DRALORIC; Manufacturer Part Number: CRCW121049R9FKTA; Power: 0.5W; TC: ±100ppm/°C; Part Number: R1210_49R9_1%_0.5W_100PPM_VISHAY_CRCW; Component Kind: Standard; Component Type: Standard; Pin Count: 2; Value: 49R9; Status: None; Tolerance: ±1%; Case: 1210; Mounted: Yes; Sense: No; Socket: No; SMD: Yes; ComponentHeight: 0.6mm; HelpURL: \\cern.ch\dfs\Applications\Altium\Datasheets\R1210_VISHAY_CRCW1210.pdf; Author: CERN DEM JMW; CreateDate: 06.08.2014; LatestRevisionDate: 06.08.2014
R66 R67 R70 R73 R92 R108 R110 R113 R116 R197 = R0402_22R_1%_0.0625W_100PPM: Resistor - 1%; Part Description: General Purpose Thick Film Chip Resistor; Manufacturer: GENERIC; Manufacturer1 Part Number: 232270672209L; TC: ±100ppm/°C; PressFit: No; Part Number: R0402_22R_1%_0.0625W_100PPM; Component Kind: Standard; Component Type: Standard; Pin Count: 2; Value: 22; Status: Not Recommended; Power: 0.0625W; Tolerance: ±1%; Manufacturer Part Number: R0402_22R_1%_0.0625W_100PPM; Case: 0402; Mounted: Yes; Sense: No; Socket: No; SMD: Yes; Manufacturer1 Example: YAGEO PHYCOMP; Manufacturer1 ComponentHeight: 0.4mm; HelpURL: \\cern.ch\dfs\Applications\Altium\Datasheets\R0402_Phycomp_RC0402.pdf; Author: CERN DEM JLC; CreateDate: 03.12.2007; LatestRevisionDate: 17.10.2012
R83 R84 R86-R89 R99 R160 R166 R179 R182-R184 R193 = R0402_510R_1%_0.0625W_100PPM: Resistor - 1%; Part Description: General Purpose Thick Film Chip Resistor; Manufacturer: GENERIC; Manufacturer1 Part Number: 232270675101L; TC: ±100ppm/°C; Part Number: R0402_510R_1%_0.0625W_100PPM; Component Kind: Standard; Component Type: Standard; Pin Count: 2; Value: 510; Status: Not recommended; Power: 0.0625W; Tolerance: ±1%; Manufacturer Part Number: R0402_510R_1%_0.0625W_100PPM; Case: 0402; Mounted: Yes; Sense: No; Socket: No; SMD: Yes; Manufacturer1 Example: YAGEO PHYCOMP; Manufacturer1 ComponentHeight: 0.4mm; HelpURL: \\cern.ch\dfs\Applications\Altium\Datasheets\R0402_Phycomp_RC0402.pdf; Author: CERN DEM JLC; CreateDate: 03.12.2007; LatestRevisionDate: 17.10.2012
R85 R98 R109 R185 = R0402_0R_JUMPER: Resistor; Part Description: 1A (0.05R Max DC Resistance) Zero Ohm Jumper; Manufacturer: GENERIC; Manufacturer1 Part Number: 232270591001L; PressFit: No; Part Number: R0402_0R_JUMPER; Component Kind: Standard; Component Type: Standard; Pin Count: 2; Value: 0; Status: Not Recommended; Manufacturer Part Number: R0402_0R_JUMPER; Case: 0402; Mounted: Yes; Sense: No; Socket: No; SMD: Yes; Manufacturer1 Example: YAGEO PHYCOMP; Manufacturer1 ComponentHeight: 0.4mm; HelpURL: \\cern.ch\dfs\Applications\Altium\Datasheets\R0402_Phycomp_RC0402.pdf; Author: CERN DEM JLC; CreateDate: 03.12.2007; LatestRevisionDate: 17.10.2012
SW2 SW4 = SW_OMRON_A6S-4102-H: 4 Ways SPST DIP Switch; Part Description: 4 Ways SPST DIP Switch, White Flat Actuator with Seal Tape, Contact Rating 25mA 24VDC; Manufacturer: OMRON; PressFit: No; Part Number: SW_OMRON_A6S-4102-H; Component Kind: Standard; Component Type: Standard; Pin Count: 8; PackageDescription: Pitch 2.54mm, Body 11.3x6.4mm, 4 Ways SPST Surface-Mounting DIP Switch, OMRON A6S-H; Family: Switch; Mounted: Yes; Socket: No; SMD: Yes; Sense: No; Status: None; Manufacturer Part Number: A6S-4102-H; ComponentHeight: 3.8mm; HelpURL: \\cern.ch\dfs\Applications\Altium\Datasheets\SW_OMRON_A6S-4102-H.pdf; Author: CERN DEM JMW; CreateDate: 25.09.2008; LatestRevisionDate: 25.09.2008
SW3 = SW_OMRON_A6S-2102-H: 2 Ways SPST DIP Switch; Part Description: 2 Ways SPST DIP Switch, White Flat Actuator with Seal Tape, Contact Rating 25mA 24VDC; Manufacturer: OMRON; PressFit: No; Part Number: SW_OMRON_A6S-2102-H; Component Kind: Standard; Component Type: Standard; Pin Count: 4; PackageDescription: Pitch 2.54mm, Body 6.2x6.4mm, 2 Ways SPST Surface-Mounting DIP Switch, OMRON A6S-H; Family: Switch; Mounted: Yes; Socket: No; SMD: Yes; Sense: No; Status: None; Manufacturer Part Number: A6S-2102-H; ComponentHeight: 3.8mm; HelpURL: \\cern.ch\dfs\Applications\Altium\Datasheets\SW_OMRON_A6S-2102-H.pdf; Author: CERN DEM JMW; CreateDate: 25.09.2008; LatestRevisionDate: 25.09.2008
T3-T16 = BSS138LT1G: N-CHANNEL MOSFET WITH DIODE; Part Description: 50V 200mA N-Channel Enhancement Mode Field-Effect Transistor; Manufacturer: ON SEMICONDUCTOR; PressFit: No; Bonding: No; Part Number: BSS138LT1G; Component Kind: Standard; Component Type: Standard; Device: BSS138LT1G; PackageDescription: SOT23 3-Leads, Pitch 0.95mm - Body 1.4x3mm, IPC Medium Density; Manufacturer Part Number: BSS138LT1G; Pin Count: 3; Case: SOT23-3; Mounted: Yes; Socket: No; SMD: Yes; Sense: No; ComponentHeight: 1.11mm; HelpURL: \\cern.ch\dfs\Applications\Altium\Datasheets\BSS138LT1G.pdf; Author: CERN DEM JLC; CreateDate: 23.03.2009; LatestRevisionDate: 23.03.2009